# Altium schematic sheet CM_DDR3.SchDoc
size Tabloid; SheetNumber: 9; SheetTotal: 14; Sheet_Name: CM_DDR3; Size: 11x17
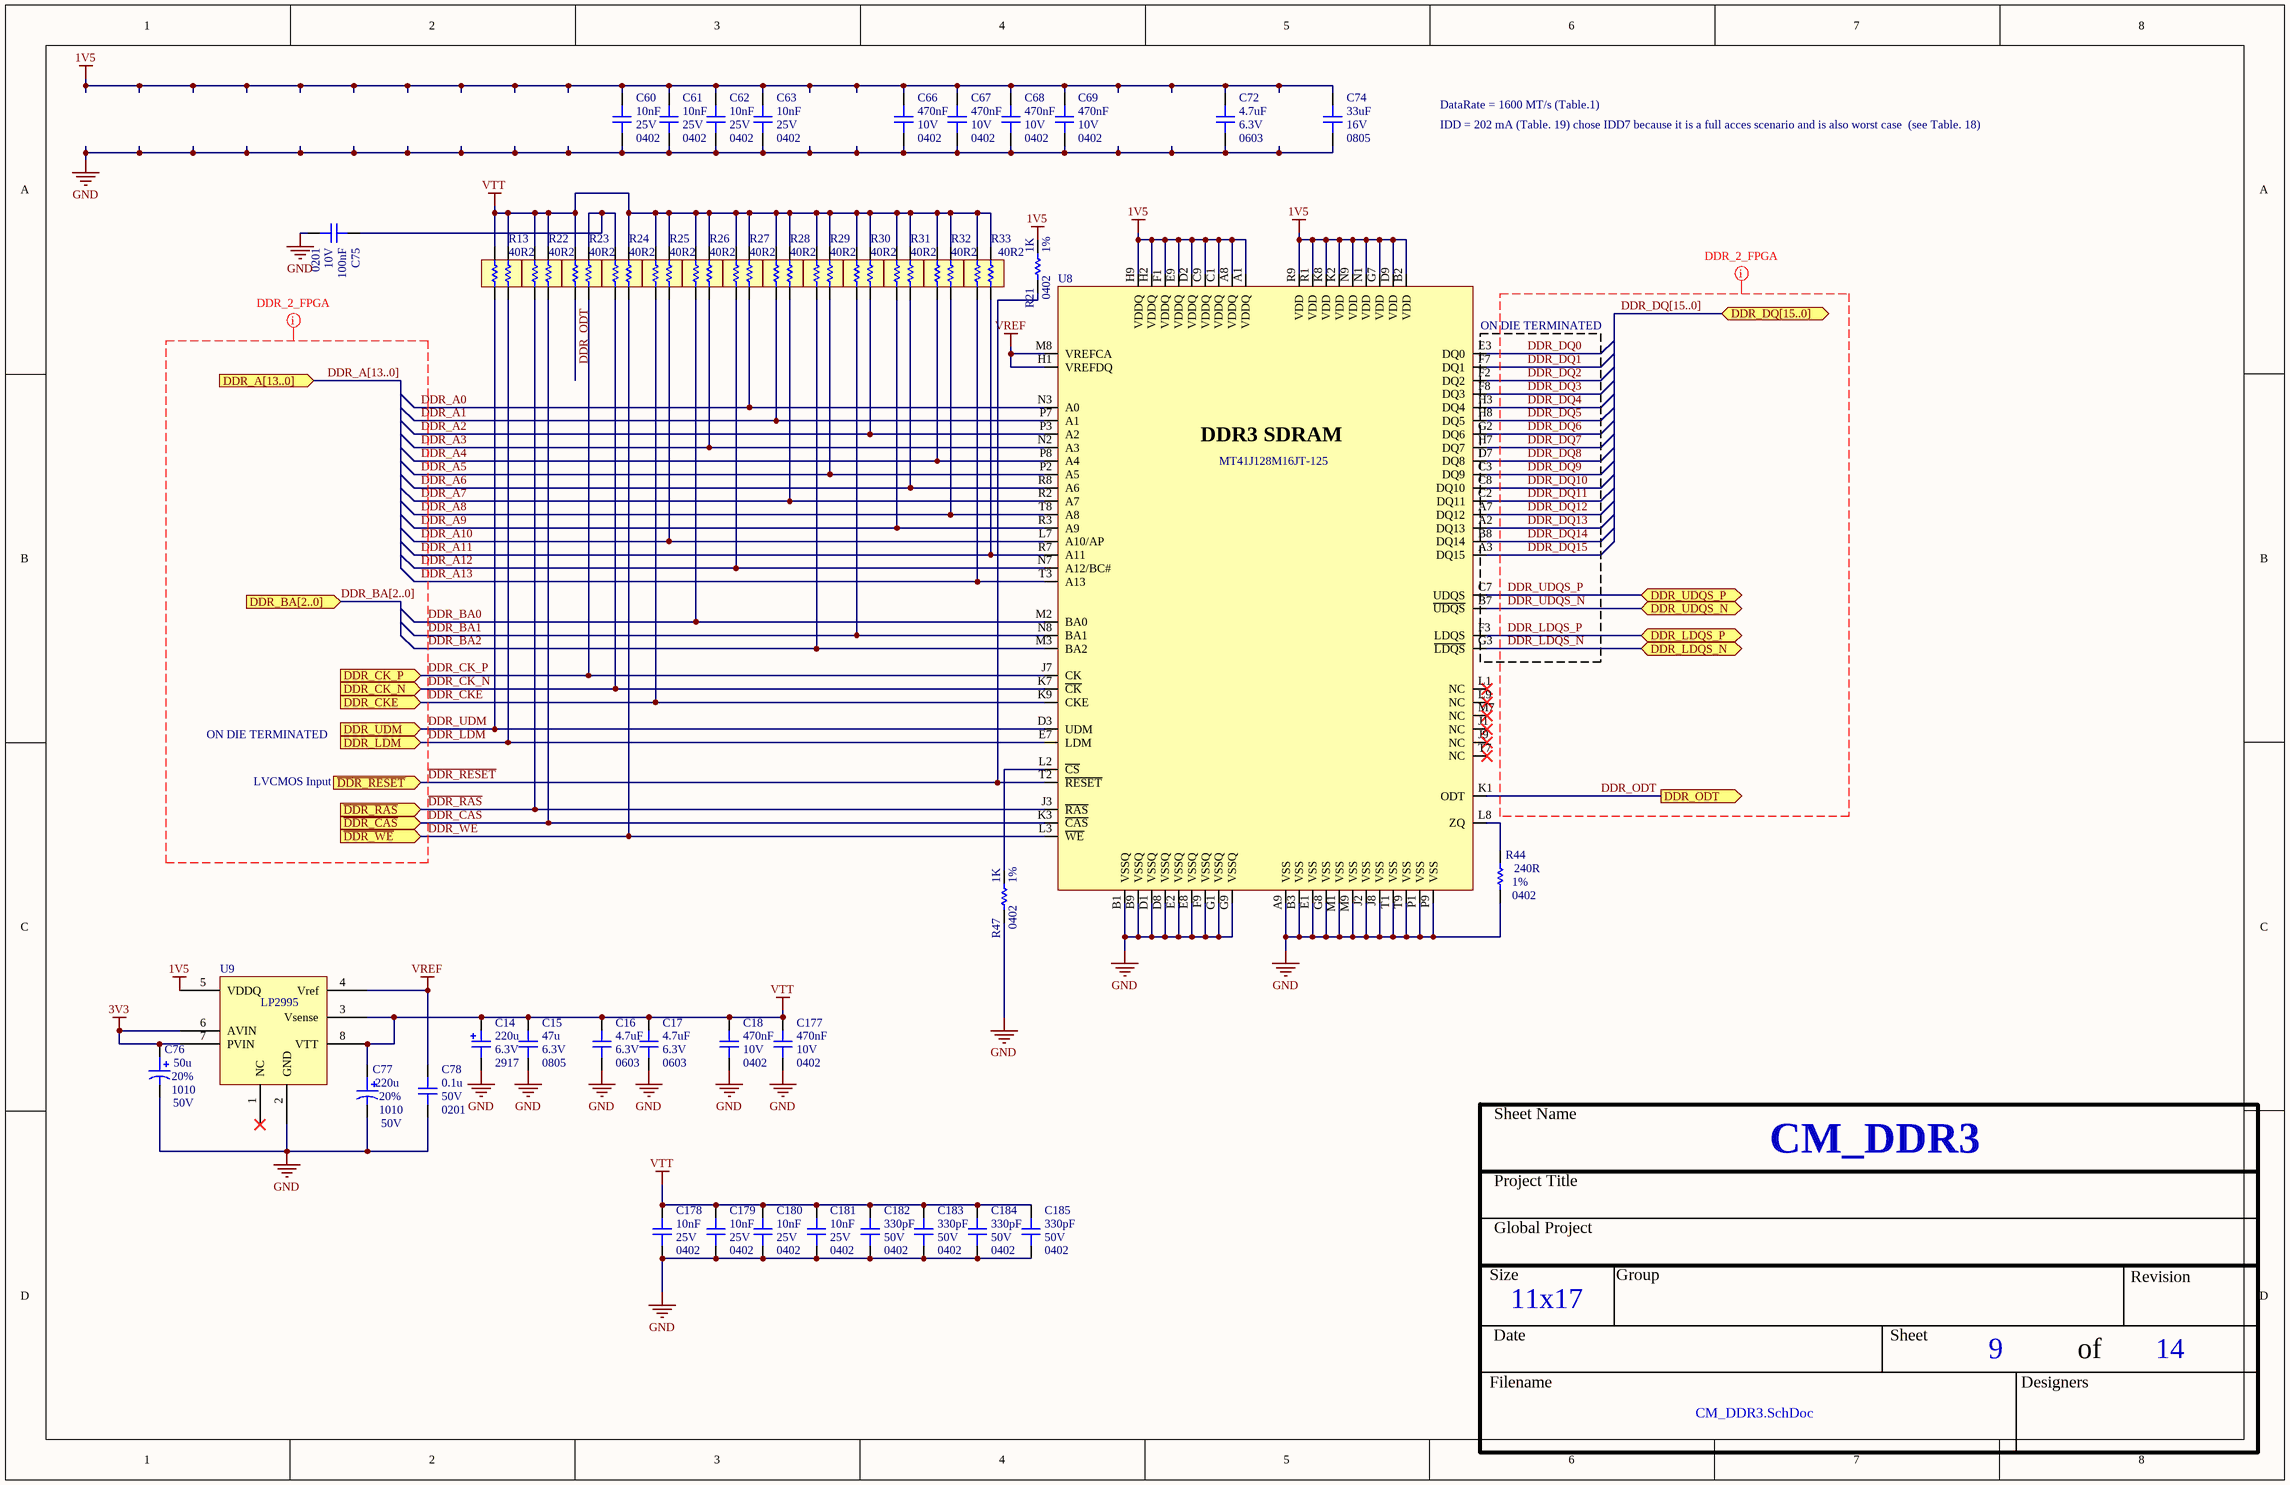
[diagram p0: CM_DDR3.SchDoc]

## Parts
C14  value 220u  Voltage: 6.3V  Package: 2917  [CAP_TAN_2917(D)]  (hidden comment: CAP - TANTALUM - CASE D)
C15  value 47u  Voltage: 6.3V  Package: 0805  [CAP_0805]  (hidden comment: CAP - 0805)
C16  value 4.7uF  Voltage: 6.3V  Package: 0603  [CAP_0603]  (hidden comment: CAP - 0603)
C17  value 4.7uF  Voltage: 6.3V  Package: 0603  [CAP_0603]  (hidden comment: CAP - 0603)
C18  value 470nF  Voltage: 10V  Package: 0402  [CAP_0402]  (hidden comment: CAP - 0402)
C60  value 10nF  Voltage: 25V  Package: 0402  [CAP_0402]  (hidden comment: CAP - 0402)
C61  value 10nF  Voltage: 25V  Package: 0402  [CAP_0402]  (hidden comment: CAP - 0402)
C62  value 10nF  Voltage: 25V  Package: 0402  [CAP_0402]  (hidden comment: CAP - 0402)
C63  value 10nF  Voltage: 25V  Package: 0402  [CAP_0402]  (hidden comment: CAP - 0402)
C66  value 470nF  Voltage: 10V  Package: 0402  [CAP_0402]  (hidden comment: CAP - 0402)
C67  value 470nF  Voltage: 10V  Package: 0402  [CAP_0402]  (hidden comment: CAP - 0402)
C68  value 470nF  Voltage: 10V  Package: 0402  [CAP_0402]  (hidden comment: CAP - 0402)
C69  value 470nF  Voltage: 10V  Package: 0402  [CAP_0402]  (hidden comment: CAP - 0402)
C72  value 4.7uF  Voltage: 6.3V  Package: 0603  [CAP_0603]  (hidden comment: CAP - 0603)
C74  value 33uF  Voltage: 16V  Package: 0805  [CAP_0805]  (hidden comment: CAP - 0805)
C75  value 100nF  Voltage: 10V  Package: 0201  [CAP_0201]  (hidden comment: CAP - 0201)
C76  value 50u  Voltage: 50V  Package: 1010  Precision: 20%  [CAP_ALU_1010_vishay]  (hidden comment: MAL215099101E3)
C77  value 220u  Voltage: 50V  Package: 1010  Precision: 20%  [CAP_ALU_1010_vishay]  (hidden comment: MAL215099101E3)
C78  value 0.1u  Voltage: 50V  Package: 0201  [CAP_0201]  (hidden comment: CAP - 0201)
C177  value 470nF  Voltage: 10V  Package: 0402  [CAP_0402]  (hidden comment: CAP - 0402)
C178  value 10nF  Voltage: 25V  Package: 0402  [CAP_0402]  (hidden comment: CAP - 0402)
C179  value 10nF  Voltage: 25V  Package: 0402  [CAP_0402]  (hidden comment: CAP - 0402)
C180  value 10nF  Voltage: 25V  Package: 0402  [CAP_0402]  (hidden comment: CAP - 0402)
C181  value 10nF  Voltage: 25V  Package: 0402  [CAP_0402]  (hidden comment: CAP - 0402)
C182  value 330pF  Voltage: 50V  Package: 0402  [CAP_0402]  (hidden comment: CAP - 0402)
C183  value 330pF  Voltage: 50V  Package: 0402  [CAP_0402]  (hidden comment: CAP - 0402)
C184  value 330pF  Voltage: 50V  Package: 0402  [CAP_0402]  (hidden comment: CAP - 0402)
C185  value 330pF  Voltage: 50V  Package: 0402  [CAP_0402]  (hidden comment: CAP - 0402)
R13  value 40R2  [CAT16-J2]  (hidden comment: Double resistor)
R21  value 1K  Package: 0402  Precision: 1%  [RES_0402]  (hidden comment: RES - 0402)
R22  value 40R2  [CAT16-J2]  (hidden comment: Double resistor)
R23  value 40R2  [CAT16-J2]  (hidden comment: Double resistor)
R24  value 40R2  [CAT16-J2]  (hidden comment: Double resistor)
R25  value 40R2  [CAT16-J2]  (hidden comment: Double resistor)
R26  value 40R2  [CAT16-J2]  (hidden comment: Double resistor)
R27  value 40R2  [CAT16-J2]  (hidden comment: Double resistor)
R28  value 40R2  [CAT16-J2]  (hidden comment: Double resistor)
R29  value 40R2  [CAT16-J2]  (hidden comment: Double resistor)
R30  value 40R2  [CAT16-J2]  (hidden comment: Double resistor)
R31  value 40R2  [CAT16-J2]  (hidden comment: Double resistor)
R32  value 40R2  [CAT16-J2]  (hidden comment: Double resistor)
R33  value 40R2  [CAT16-J2]  (hidden comment: Double resistor)
R44  value 240R  Package: 0402  Precision: 1%  [RES_0402]  (hidden comment: RES - 0402)
R47  value 1K  Package: 0402  Precision: 1%  [RES_0402]  (hidden comment: RES - 0402)
U8  MT41J128M16JT-125  [MEM_DDR3_MT41J128M16JT-125]
U9  LP2995  [SOP8]

## Ports
DDR_A[13..0] (in), DDR_BA[2..0] (in), DDR_CK_N (in), DDR_CK_P (in), DDR_CKE (in), DDR_DQ[15..0] (bidir), DDR_LDM (in), DDR_LDQS_N (bidir), DDR_LDQS_P (bidir), DDR_ODT (out), DDR_UDM (in), DDR_UDQS_N (bidir), DDR_UDQS_P (bidir), ~{DDR_CAS} (in), ~{DDR_RAS} (in), ~{DDR_RESET} (in), ~{DDR_WE} (in)

## Nets
1V5: C60.2 C61.2 C62.2 C63.2 C66.2 C67.2 C68.2 C69.2 C72.2 C74.2 R21.2 U8.A1(VDDQ) U8.A8(VDDQ) U8.B2(VDD) U8.C1(VDDQ) U8.C9(VDDQ) U8.D2(VDDQ) U8.D9(VDD) U8.E9(VDDQ) U8.F1(VDDQ) U8.G7(VDD) U8.H2(VDDQ) U8.H9(VDDQ) U8.K2(VDD) U8.K8(VDD) U8.N1(VDD) U8.N9(VDD) U8.R1(VDD) U8.R9(VDD) U9.5(VDDQ)
3V3: C76.1 U9.6(AVIN) U9.7(PVIN)
GND: C14.1 C15.1 C16.1 C17.1 C18.1 C60.1 C61.1 C62.1 C63.1 C66.1 C67.1 C68.1 C69.1 C72.1 C74.1 C75.1 C76.2 C77.2 C78.1 C177.1 C178.1 C179.1 C180.1 C181.1 C182.1 C183.1 C184.1 C185.1 R44.1 R47.1 U8.A9(VSS) U8.B1(VSSQ) U8.B3(VSS) U8.B9(VSSQ) U8.D1(VSSQ) U8.D8(VSSQ) U8.E1(VSS) U8.E2(VSSQ) U8.E8(VSSQ) U8.F9(VSSQ) U8.G1(VSSQ) U8.G8(VSS) U8.G9(VSSQ) U8.J2(VSS) U8.J8(VSS) U8.M1(VSS) U8.M9(VSS) U8.P1(VSS) U8.P9(VSS) U8.T1(VSS) U8.T9(VSS) U9.2(GND)
VREF: C78.2 U8.H1(VREFDQ) U8.M8(VREFCA) U9.4(Vref)
VTT: C14.2 C15.2 C16.2 C17.2 C18.2 C77.1 C177.2 C178.2 C179.2 C180.2 C181.2 C182.2 C183.2 C184.2 C185.2 R13.3 R13.4 R22.3 R22.4 R23.4 R24.3 R25.3 R25.4 R26.3 R26.4 R27.3 R27.4 R28.3 R28.4 R29.3 R29.4 R30.3 R30.4 R31.3 R31.4 R32.3 R32.4 R33.3 R33.4 U9.3(Vsense) U9.8(VTT)
~{DDR_CAS}: R22.2 U8.K3(~{CAS}) ; port ~{DDR_CAS}
~{DDR_RAS}: R22.1 U8.J3(~{RAS}) ; port ~{DDR_RAS}
~{DDR_RESET}: R21.1 U8.T2(~{RESET}) ; port ~{DDR_RESET}
~{DDR_WE}: R24.2 U8.L3(~{WE}) ; port ~{DDR_WE}
DDR_A0: R27.2 U8.N3(A0)
DDR_A1: R28.1 U8.P7(A1)
DDR_A2: R30.2 U8.P3(A2)
DDR_A3: R26.2 U8.N2(A3)
DDR_A4: R32.1 U8.P8(A4)
DDR_A5: R29.2 U8.P2(A5)
DDR_A6: R31.2 U8.R8(A6)
DDR_A7: R28.2 U8.R2(A7)
DDR_A8: R32.2 U8.T8(A8)
DDR_A9: R31.1 U8.R3(A9)
DDR_A10: R25.2 U8.L7(A10/AP)
DDR_A11: R33.2 U8.R7(A11)
DDR_A12: R27.1 U8.N7(A12/BC#)
DDR_A13: R33.1 U8.T3(A13)
DDR_BA0: R26.1 U8.M2(BA0)
DDR_BA1: R30.1 U8.N8(BA1)
DDR_BA2: R29.1 U8.M3(BA2)
DDR_CK_N: R24.1 U8.K7(~{CK}) ; port DDR_CK_N
DDR_CK_P: R23.2 U8.J7(CK) ; port DDR_CK_P
DDR_CKE: R25.1 U8.K9(CKE) ; port DDR_CKE
DDR_DQ0: U8.E3(DQ0)
DDR_DQ1: U8.F7(DQ1)
DDR_DQ2: U8.F2(DQ2)
DDR_DQ3: U8.F8(DQ3)
DDR_DQ4: U8.H3(DQ4)
DDR_DQ5: U8.H8(DQ5)
DDR_DQ6: U8.G2(DQ6)
DDR_DQ7: U8.H7(DQ7)
DDR_DQ8: U8.D7(DQ8)
DDR_DQ9: U8.C3(DQ9)
DDR_DQ10: U8.C8(DQ10)
DDR_DQ11: U8.C2(DQ11)
DDR_DQ12: U8.A7(DQ12)
DDR_DQ13: U8.A2(DQ13)
DDR_DQ14: U8.B8(DQ14)
DDR_DQ15: U8.A3(DQ15)
DDR_LDM: R13.2 U8.E7(LDM) ; port DDR_LDM
DDR_LDQS_N: U8.G3(~{LDQS}) ; port DDR_LDQS_N
DDR_LDQS_P: U8.F3(LDQS) ; port DDR_LDQS_P
DDR_ODT: R23.1 U8.K1(ODT) ; port DDR_ODT
DDR_UDM: R13.1 U8.D3(UDM) ; port DDR_UDM
DDR_UDQS_N: U8.B7(~{UDQS}) ; port DDR_UDQS_N
DDR_UDQS_P: U8.C7(UDQS) ; port DDR_UDQS_P
NetC75_2: C75.2 R23.3 R24.4
NetR44_2: R44.2 U8.L8(ZQ)
NetR47_2: R47.2 U8.L2(~{CS})

Not connected (* = marked no-connect by the designer): U8 J1(NC)* J9(NC)* L1(NC)* L9(NC)* M7(NC)* T7(NC)*; U9 1(NC)*

## Buses and harness runs
bus DDR_A[13..0] = port DDR_A[13..0]
bus DDR_BA[2..0] = port DDR_BA[2..0]
bus DDR_DQ[15..0] = port DDR_DQ[15..0]

## Layout directives
net class DDR_2_FPGA: DDR_A0, DDR_A1, DDR_A2, DDR_A3, DDR_A4, DDR_A5, DDR_A6, DDR_A7, DDR_A8, DDR_A9, DDR_A10, DDR_A11, DDR_A12, DDR_A13, DDR_A[13..0], DDR_BA0, DDR_BA1, DDR_BA2, DDR_BA[2..0], DDR_CK_N, DDR_CK_P, DDR_CKE, DDR_DQ0, DDR_DQ1, DDR_DQ2, DDR_DQ3, DDR_DQ4, DDR_DQ5, DDR_DQ6, DDR_DQ7, DDR_DQ8, DDR_DQ9, DDR_DQ10, DDR_DQ11, DDR_DQ12, DDR_DQ13, DDR_DQ14, DDR_DQ15, DDR_DQ[15..0], DDR_LDM, DDR_LDQS_N, DDR_LDQS_P, DDR_ODT, DDR_UDM, DDR_UDQS_N, DDR_UDQS_P, ~{DDR_CAS}, ~{DDR_RAS}, ~{DDR_RESET}, ~{DDR_WE}

## Notes on the sheet
- DataRate = 1600 MT/s (Table.1)
- IDD = 202 mA (Table. 19) chose IDD7 because it is a full acces scenario and is also worst case  (see Table. 18)
- (near U8) ON DIE TERMINATED
- ON DIE TERMINATED
- LVCMOS Input
- Sheet Name
- Project Title
- Global Project
- Size
- Group
- Revision
- Date
- Sheet
- of
- Filename
- Designers
- (in symbol MEM_DDR3_MT41J128M16JT-125:K TR) DDR3 SDRAM

## Library data of the parts
C14 = CAP_TANT_2917(D): CAP - TANTALUM - 2917; Precision: 10%; Current: *; CreatedBy: Jonathan Bouchard; Power: *
C15 C74 = CAP - 0805: Precision: 10%; Current: *; CreatedBy: Jonathan Bouchard; Power: *
C16 C17 C72 = CAP - 0603: Precision: 10%; Current: *; CreatedBy: Jonathan Bouchard; Power: *
C18 C60-C63 C66-C69 C177-C185 = CAP - 0402: Precision: 10%; Current: *; CreatedBy: Jonathan Bouchard; Power: *
C75 C78 = CAP - 0201: Precision: 10%; Current: *; CreatedBy: Jonathan Bouchard; Power: *
C76 C77 = CAP_ALU_MAL215099101E3: CAP - ALU 100uF 20% 50V - 1010; Current: 490mA; Mfg: Vishay Dale; Mfg Part Number: MAL215099101E3; HelpURL: http://www.vishay.com/docs/28395/150crz.pdf; CreatedBy: Jonathan Bouchard; Temperature: -55°C to 125°C; Power: *; Supplier 1: Digikey; Supplier Part Number 1: 4399PHDKR-ND
R21 R44 R47 = RES - 0402: Voltage: 50V; Power: 1/16W; Current: *; CreatedBy: Jonathan Bouchard
U8 = MEM_DDR3_MT41J128M16JT-125:K TR: MEM - DDR3 SDRAM 2GBIT 800MHZ - TFBGA-96; Voltage: 1.425 V ~ 1.575 V; Mfg: Micrel; Current: *; Power: *; Mfg Part Number: http://www.micron.com/~/media/Documents/Products/Data%20Sheet/DRAM/DDR3/2Gb_DDR3_SDRAM.pdf; HelpURL: http://ww1.microchip.com/downloads/en/DeviceDoc/00002275A.pdf; CreatedBy: Jonathan Bouchard; Temperature: 0°C ~ 95°C (TC); Value: *; Precision: *; Package: TFBGA-96; Supplier 1: Digikey; Supplier Part Number 1: 557-1611-1-ND